# Altium schematic sheet PA-HF_100W.SchDoc
size A4; SheetNumber: 2; SheetTotal: 5
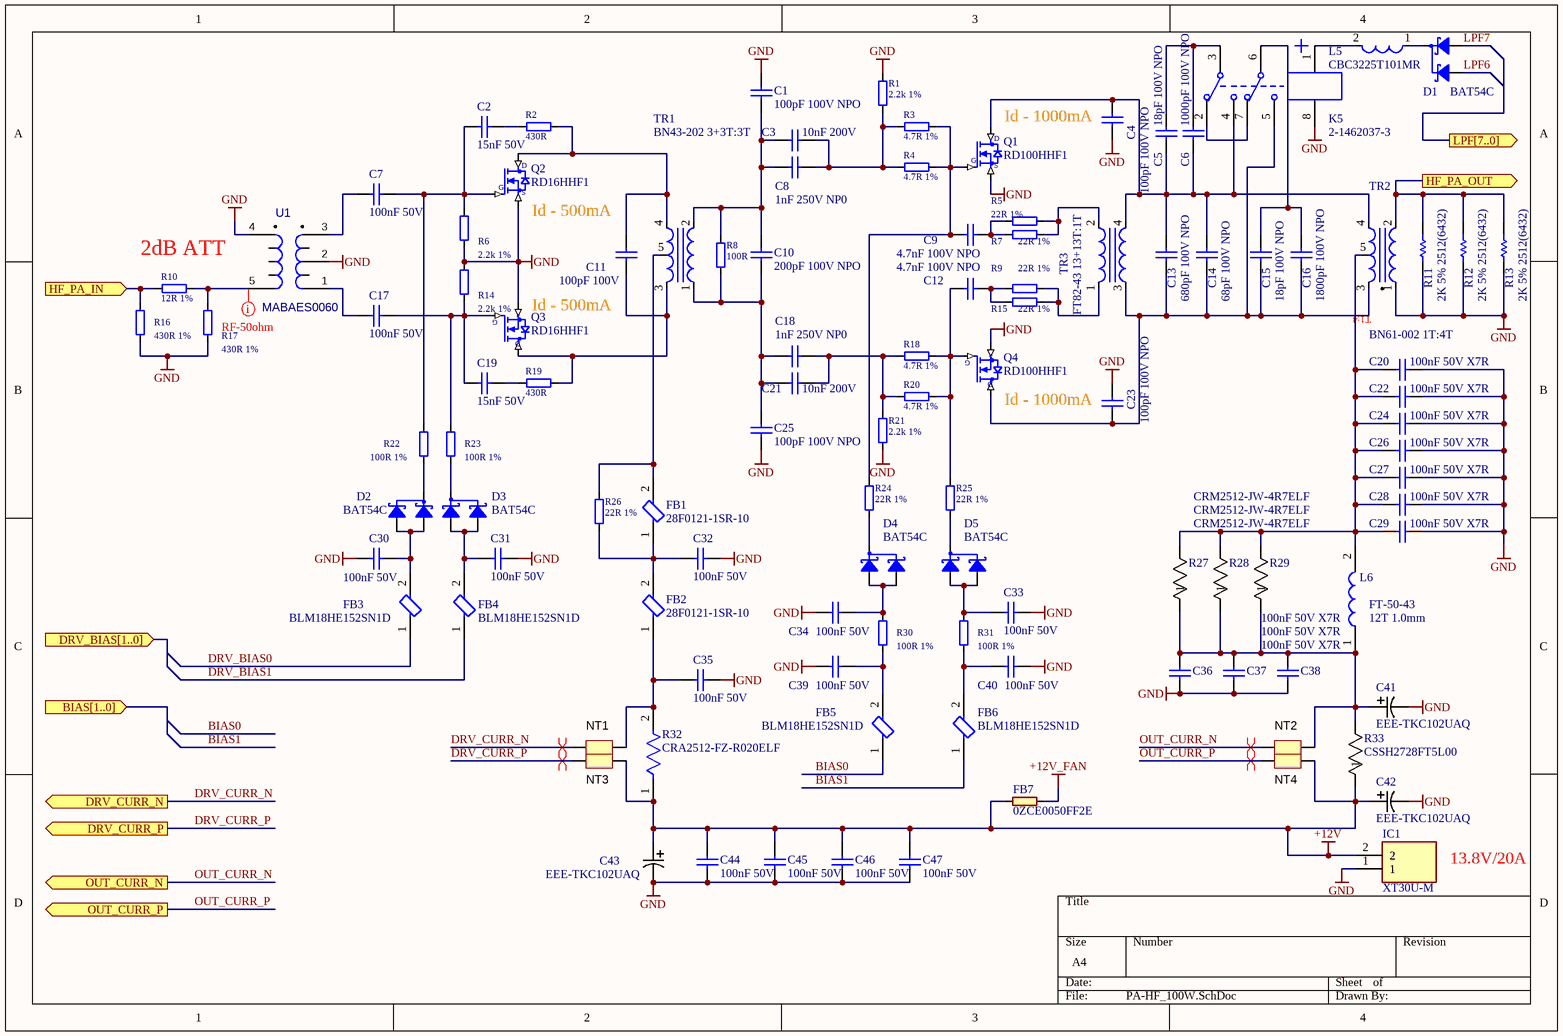
[diagram p0: PA-HF_100W.SchDoc]

## Parts
C1  100pF 100V NPO  [C-1206]
C2  15nF 50V  [C-0805]
C3  10nF 200V  [C-1206]
C4  100pF 100V NPO  [C-1206]
C5  18pF 100V NPO  [C-1206]
C6  1000pF 100V NPO  [C-1206]
C7  100nF 50V  [C-0805]
C8  1nF 250V NP0  [C-1206]
C9  4.7nF 100V NPO  [C-1206]
C10  200pF 100V NPO  [C-1206]
C11  100pF 100V  [C-0805]
C12  4.7nF 100V NPO  [C-1206]
C13  680pF 100V NPO  [C-1206]
C14  68pF 100V NPO  [C-1206]
C15  18pF 100V NPO  [C-1206]
C16  1800pF 100V NPO  [C-1206]
C17  100nF 50V  [C-0805]
C18  1nF 250V NP0  [C-1206]
C19  15nF 50V  [C-0805]
C20  100nF 50V X7R  [C-1206]
C21  10nF 200V  [C-1206]
C22  100nF 50V X7R  [C-1206]
C23  100pF 100V NPO  [C-1206]
C24  100nF 50V X7R  [C-1206]
C25  100pF 100V NPO  [C-1206]
C26  100nF 50V X7R  [C-1206]
C27  100nF 50V X7R  [C-1206]
C28  100nF 50V X7R  [C-1206]
C29  100nF 50V X7R  [C-1206]
C30  100nF 50V  [C-0805]
C31  100nF 50V  [C-0805]
C32  100nF 50V  [C-0805]
C33  100nF 50V  [C-0805]
C34  100nF 50V  [C-0805]
C35  100nF 50V  [C-0805]
C36  100nF 50V X7R  [C-1206]
C37  100nF 50V X7R  [C-1206]
C38  100nF 50V X7R  [C-1206]
C39  100nF 50V  [C-0805]
C40  100nF 50V  [C-0805]
C41  EEE-TKC102UAQ  [CAP_PAN_EEE_H13_PAN]
C42  EEE-TKC102UAQ  [CAP_PAN_EEE_H13_PAN]
C43  EEE-TKC102UAQ  [CAP_PAN_EEE_H13_PAN]
C44  100nF 50V  [C-0805]
C45  100nF 50V  [C-0805]
C46  100nF 50V  [C-0805]
C47  100nF 50V  [C-0805]
D1  BAT54C  [SOT-23]
D2  BAT54C  [SOT-23]
D3  BAT54C  [SOT-23]
D4  BAT54C  [SOT-23]
D5  BAT54C  [SOT-23]
FB1  28F0121-1SR-10  [FP-28F0121-1SR-10-MFG]
FB2  28F0121-1SR-10  [FP-28F0121-1SR-10-MFG]
FB3  BLM18HE152SN1D  [FP-BLM18-0_15-t0_8-IPC_C]
FB4  BLM18HE152SN1D  [FP-BLM18-0_15-t0_8-IPC_C]
FB5  BLM18HE152SN1D  [FP-BLM18-0_15-t0_8-IPC_C]
FB6  BLM18HE152SN1D  [FP-BLM18-0_15-t0_8-IPC_C]
FB7  0ZCE0050FF2E  [C-0805]
IC1  XT30U-M  [XT30UM]
K5  2-1462037-3  [TECO-2-1462037-3_V]
L5  CBC3225T101MR  [FP-CB3225-MFG]
L6  FT-50-43  value 12T 1.0mm  [Amidon_FT50_43]
NT1  Net-Tie  [Net-Tie_10mil]  (value not drawn)  (net tie, no BOM)
NT2  Net-Tie  [Net-Tie_10mil]  (value not drawn)  (net tie, no BOM)
NT3  Net-Tie  [Net-Tie_10mil]  (value not drawn)  (net tie, no BOM)
NT4  Net-Tie  [Net-Tie_10mil]  (value not drawn)  (net tie, no BOM)
Q1  RD100HHF1  [RD100HHF1]
Q2  RD16HHF1  [RD16HHF1]
Q3  RD16HHF1  [RD16HHF1]
Q4  RD100HHF1  [RD100HHF1]
R1  2.2k 1%  [R-1206]
R2  430R  [R-1206]
R3  4.7R 1%  [R-1206]
R4  4.7R 1%  [R-1206]
R5  22R 1%  [R-1206]
R6  2.2k 1%  [R-0805]
R7  22R 1%  [R-1206]
R8  100R  [R-1206]
R9  22R 1%  [R-1206]
R10  12R 1%  [R-0805]
R11  2K 5% 2512(6432)  [RESC2512(6432)_N]
R12  2K 5% 2512(6432)  [RESC2512(6432)_N]
R13  2K 5% 2512(6432)  [RESC2512(6432)_N]
R14  2.2k 1%  [R-0805]
R15  22R 1%  [R-1206]
R16  430R 1%  [R-0805]
R17  430R 1%  [R-0805]
R18  4.7R 1%  [R-1206]
R19  430R  [R-1206]
R20  4.7R 1%  [R-1206]
R21  2.2k 1%  [R-1206]
R22  100R 1%  [R-0805]
R23  100R 1%  [R-0805]
R24  22R 1%  [R-1206]
R25  22R 1%  [R-1206]
R26  22R 1%  [R-1206]
R27  CRM2512-JW-4R7ELF  [BO_CR2512]
R28  CRM2512-JW-4R7ELF  [BO_CR2512]
R29  CRM2512-JW-4R7ELF  [BO_CR2512]
R30  100R 1%  [R-0805]
R31  100R 1%  [R-0805]
R32  CRA2512-FZ-R020ELF  [FP-CRA2512-IPC_C]
R33  CSSH2728FT5L00  [STA_CSSH2728_STP]
TR1  BN43-202 3+3T:3T  [BN43-202]
TR2  BN61-002 1T:4T  [BN61-002]
TR3  FT82-43 13+13T:1T  [Amidon_FT82-43]
U1  MABAES0060  [TRANSF_ACORE2]

## Ports
BIAS[1..0] (in), DRV_BIAS[1..0] (in), DRV_CURR_N (out), DRV_CURR_P (out), HF_PA_IN (in), HF_PA_OUT (out), LPF[7..0] (out), OUT_CURR_N (out), OUT_CURR_P (out)

## Nets
+12V: C42.1 C43.1 C44.2 C45.2 C46.2 C47.2 FB7.1 IC1.2 NT3.2 NT4.2 R32.1 R33.1
+12V_FAN: FB7.2
GND: C1.1 C4.2 C20.1 C22.1 C23.1 C24.1 C25.2 C26.1 C27.1 C28.1 C29.1 C30.2 C31.1 C32.1 C33.1 C34.1 C35.1 C36.1 C37.1 C38.1 C39.1 C40.1 C41.2 C42.2 C43.2 C44.1 C45.1 C46.1 C47.1 IC1.1 K5.8 Q1.1(S) Q2.1(S) Q3.1(S) Q4.1(S) R1.2 R6.1 R11.1 R12.1 R13.1 R14.2 R16.1 R17.1 R21.2 TR2.1 U1.2(S2) U1.4(P1)
BIAS0: FB5.1
BIAS1: FB6.1
DRV_BIAS0: FB3.1
DRV_BIAS1: FB4.1
DRV_CURR_N: NT1.1 ; port DRV_CURR_N
DRV_CURR_P: NT3.1 ; port DRV_CURR_P
HF_PA_IN: R10.1 R16.2 ; port HF_PA_IN
HF_PA_OUT: R11.2 R12.2 R13.2 TR2.2 ; port HF_PA_OUT
LPF6: D1.2
LPF7: D1.1
OUT_CURR_N: NT2.1 ; port OUT_CURR_N
OUT_CURR_P: NT4.1 ; port OUT_CURR_P
NetC1_2: C1.2 C3.1 C8.1 C10.1 R8.2 TR1.2
NetC2_1: C2.1 C7.2 Q2.2 R6.2 R22.2
NetC2_2: C2.2 R2.1
NetC3_2: C3.2 C8.2 R1.1 R3.1 R4.1
NetC4_1: C4.1 C5.1 C6.1 C13.1 C14.1 K5.4 Q1.3(D) TR2.4 TR3.4
NetC5_2: C5.2 C6.2 K5.3
NetC7_1: C7.1 U1.3(S1)
NetC9_1: C9.1 Q1.2 R3.2 R4.2 R24.2
NetC9_2: C9.2 R5.1 R7.1
NetC10_2: C10.2 C18.1 C21.1 C25.1 R8.1 TR1.1
NetC11_1: C11.1 Q3.3(D) R19.2 TR1.3
NetC11_2: C11.2 Q2.3(D) R2.2 TR1.4
NetC12_1: C12.1 Q4.2 R18.2 R20.2 R25.2
NetC12_2: C12.2 R9.1 R15.1
NetC13_2: C13.2 C14.2 C15.1 C16.2 C23.2 K5.5 Q4.3(D) TR2.3 TR3.3
NetC15_2: C15.2 C16.1 K5.6
NetC17_1: C17.1 U1.1(S3)
NetC17_2: C17.2 C19.1 Q3.2 R14.1 R23.2
NetC18_2: C18.2 C21.2 R18.1 R20.1 R21.1
NetC19_2: C19.2 R19.1
NetC20_2: C20.2 C22.2 C24.2 C26.2 C27.2 C28.2 C29.2 L6.2 R27.2 R28.2 R29.2 TR2.5
NetC30_1: C30.1 D2.1 D2.2 FB3.2
NetC31_2: C31.2 D3.1 D3.2 FB4.2
NetC32_2: C32.2 FB1.1 FB2.2 R26.1
NetC33_2: C33.2 D5.1 D5.2 R31.2
NetC34_2: C34.2 D4.1 D4.2 R30.2
NetC35_2: C35.2 FB2.1 NT1.2 R32.2
NetC36_2: C36.2 C37.2 C38.2 C41.1 L6.1 NT2.2 R27.1 R28.1 R29.1 R33.2
NetC39_2: C39.2 FB5.2 R30.1
NetC40_2: C40.2 FB6.2 R31.1
NetD1_3: D1.3 L5.1
NetD2_3: D2.3 R22.1
NetD3_3: D3.3 R23.1
NetD4_3: D4.3 R24.1
NetD5_3: D5.3 R25.1
NetFB1_2: FB1.2 R26.2 TR1.5
NetK5_1: K5.1 L5.2
NetK5_2: K5.2 K5.7
NetR5_2: R5.2 R7.2 TR3.2
NetR9_2: R9.2 R15.2 TR3.1
NetR10_2: R10.2 R17.2 U1.5(P2)

## Layout directives
differential pair: DRV_CURR_N, DRV_CURR_P, OUT_CURR_N, OUT_CURR_P
rule Width Constraint [Pref Impedance = 50,00ohms    Min Impedance = 50,00ohms    Max Impedance = 50,00ohms]: NetR10_2

## Notes on the sheet
- Id - 1000mA
- (near Q2) Id - 500mA
- (near R10) 2dB ATT
- (near Q3) Id - 500mA
- 13.8V/20A
- (in symbol BN61-002 1T:4T) T1:4
- (in symbol RD16HHF1) G
- (in symbol RD100HHF1) G

## Library data of the parts
C1-C19 C21 C23 C25 C30-C35 C39 C40 C44-C47 = C semi: Ceramic Multilayer Capacitor
C20 C22 C24 C26-C29 C36-C38 = C semi: Ceramic Multilayer Capacitor; Manufacturer P/N: C1206C104K5RAC7867
C41-C43 = EEE-TKC102UAQ: No Description Available; Mfr_Name: Panasonic; Type: DEV; Copyright: Copyright (C) 2022 Ultra Librarian. All rights reserved.; Manufacturer_Part_Number: EEE-TKC102UAQ; RefDes: RefDes
D1-D5 = D SH SOT23C: Schottky barrier diodes; Manufacturer: NXP; TypeNum: 435; Parameters: VR 30V, IF 200mA; Note: *; Link: *; Manufacturer P/N: BAT54C
FB1 FB2 = CMP-19111-000017-1: FERRITE BEAD 96 OHM 2SMD 1LN; Current Rating: 10A; Frequency: 100MHz; DC Resistance (DCR): 1mR; Impedance: 96R; Number of Lines: 1; Depth: 3.05mm; Width: 0.12inch; Min Operating Temperature: -40°C; Series: 28; Lead Free: Lead Free; Max DC Current: 10A; Case/Package: SMD/SMT; Termination: SMD/SMT; Max Operating Temperature: 125°C; Mount: Surface Mount; Case Code (Imperial): 3312; Material: Ferrite; Case Code (Metric): 8531; Packaging: Tape and Reel; Length: 0.335inch; RoHS Compliant: Yes; Test Frequency: 100MHz; Weight: 0.01056oz; Max Current Rating: 10A; Height: 0.12inch; Contact Plating: Tin; Package Quantity: 1
FB3-FB6 = CMP-0686-00368-3: Chip Ferrite Bead, 0603, 1500Ω @ 100MHz, 0.5Ω, 25%, 500mA; Impedance: 1.5kR; DC Resistance (DCR): 500mR; Number of Circuits: 1; Test Frequency: 100MHz; Case/Package: 0603; Max Operating Temperature: 125°C; Package Quantity: 1; Max DC Current: 500mA; Tolerance: 25%; Core Material: Ferrite; Width: 0.8mm; Number of Pins: 2; Depth: 0.8mm; Radiation Hardening: No; Case Code (Imperial): 0603; Min Operating Temperature: -55°C; Termination: SMD/SMT; Material: Ferrite; Military Standard: Not; Number of Lines: 1; DC Current: 500mA; Length: 1.6mm; REACH SVHC: No SVHC; Lead Free: Lead Free; Current Rating: 500mA; Max Current Rating: 500mA; Packaging: Tape and Reel; Case Code (Metric): 1608; Height: 0.8mm
FB7 = L BEAD SMD: Chip Ferrite Bead; Manufacturer: KING CORE; Manufacturer P/N: FBM-11-160808-470T; numsch: 031; TypeNum: 315; Parameters: Z=47 ±25%, 300mA; Current: *
IC1 = XT30U-M: Integrated Circuit; Manufacturer_Name: Amass; Datasheet Link: https://www.tme.eu/Document/3cbfa5cfa544d79584972dd5234a409e/XT30U%20SPEC.pdf; Height: 10.7mm; Manufacturer_Part_Number: XT30U-M
K5 = CMP-2000-05409-1: Signal Relay, 2 A, 12 VDC, -40 to 85 degC, 8-Pin SMD, RoHS, Tape and Reel; Manufacturer: TE Connectivity; Coil Suppression Diode: No; Contact Arrangement: DPDT; Product Length (mm): 10mm; Product Height (mm): 5.65mm; Coil Voltage DC: 12V; Pick-up Voltage (Max): 9VDC; Coil Resistance: 1.029kohm; Voltage Rating (VDC): 220; Dropout Volt: 1.2VDC; Operate Time: 1ms; Contact Current Rating: 2A; Relay Construction: Non-Latching; Seal: Unsealed; Maximum Power Rating: 60W/62.5VA; Product Depth (mm): 7.5mm; Coil Current: 11.67mA; Voltage Rating (VAC): 250V; Contact Form: 2FormC; Contact Material: PalladiumRuthenium/Gold; Pin Count: 8; LED Indicator: No; Operating Temp Range: -40Cto85C; Push To Test Button: No; Mounting Style: SurfaceMount; Type: SignalRelay; Packaging: TapeandReel; Datasheet Version: Rev. 0116, 01/2016; Manufacturer URL: http://www.te.com/; Datasheet URL: http://www.te.com/commerce/DocumentDelivery/DDEController?Action=srchrtrv&DocNm=108-98001&DocType=SS&DocLang=EN; Termination Style: GullWing
L5 = CMP-14484-000373-1: SMD Inductors 100uH ±20% 0.34A 1.82Ω 1210; Resistance: 1.4R; DC Current: 340mA; DC Resistance (DCR): 1.82R; Saturation Current: 270mA; Self Resonant Frequency: 6MHz; Core Material: Ferrite; Inductor Type: POWER; Shielding: Unshielded; Test Frequency: 100kHz; Max Operating Temperature: 105°C; Length: 0.126inch; Inductance: 100uH; Current Rating: 340mA; Resistor Type: Wirewound; Halogen Free: Halogen Free; Height - Seated (Max): 0.106inch; Case/Package: 1210; Package Quantity: 1000; Lead Free: Lead Free; Series: CB; Tolerance: 20%; Depth: 2.7mm; Number of Pins: 2; Width: 0.098inch; Termination: SMD/SMT; Min Operating Temperature: -40°C; Max DC Current: 340mA; Inductance Tolerance: 20%; Radiation Hardening: No; Military Standard: Not; Height: 2.5mm; Case Code (Metric): 3225; Packaging: Tape and Reel; Mount: Surface Mount; RoHS Compliant: Yes; Case Code (Imperial): 1210
L6 = Amidon
NT1-NT4 = Net-Tie: Single point connection between nets.; SymbolCreator: codlsc; SymbolVersion: 2009-07-01; MountType: SMT; PackageReference: N/A; Publisher: Texas Instruments; LatestRevisionDate: 2014-12-30; LatestRevisionNote: Added Alternate PartNumber and Alternate Manufacturer parameters to appropriate components.
R1-R10 R14-R25 R30 R31 = RES semi: Chip Resistor; Power: *; TCR: *; Series: *; Tolerance: *
R11-R13 = CMP-1018-00105-1: 2K 1W 5% 2512 (6432 Metric)  SMD; Case-Metric: 6432; Case-EIA: 2512; Value: 2000.00 Ohm; Power: 1 W; Technology: SMT; Tolerance: 5 %
R26 = RES semi: Chip Resistor; Manufacturer P/N: RC1206FR-0722RL; Power: *; TCR: *; Series: *; Tolerance: *
R27-R29 = CRM2512-JW-4R7ELF: No Description Available; Mfr_Name: Bourns Electronics; Copyright: Copyright (C) 2022 Ultra Librarian. All rights reserved.; Manufacturer_Part_Number: CRM2512-JW-4R7ELF; RefDes: RefDes; Type: DEV
R32 = CMP-07231-006693-1: RES 0.02 OHM 1% 3W 2512
R33 = CSSH2728FT5L00: No Description Available; Mfr_Name: Stackpole International; Copyright: Copyright (C) 2022 Ultra Librarian. All rights reserved.; Manufacturer_Part_Number: CSSH2728FT5L00; RefDes: RefDes; Type: DEV
TR1 = BN43-202 3+3T:3T: BN43-202 3+3T:3T 0.5mm
TR2 = BN61-002 1T:4T: BN61-002 1T:4T 25ohms coaxial
TR3 = FT82-43 13+13T:1T: BN43-202 3+3T:3T 0.5mm
U1 = MABAES0060: 1:1; Value: *